# Altium schematic sheet lipo battery.SchDoc
size A; SheetNumber: 1; SheetTotal: 1
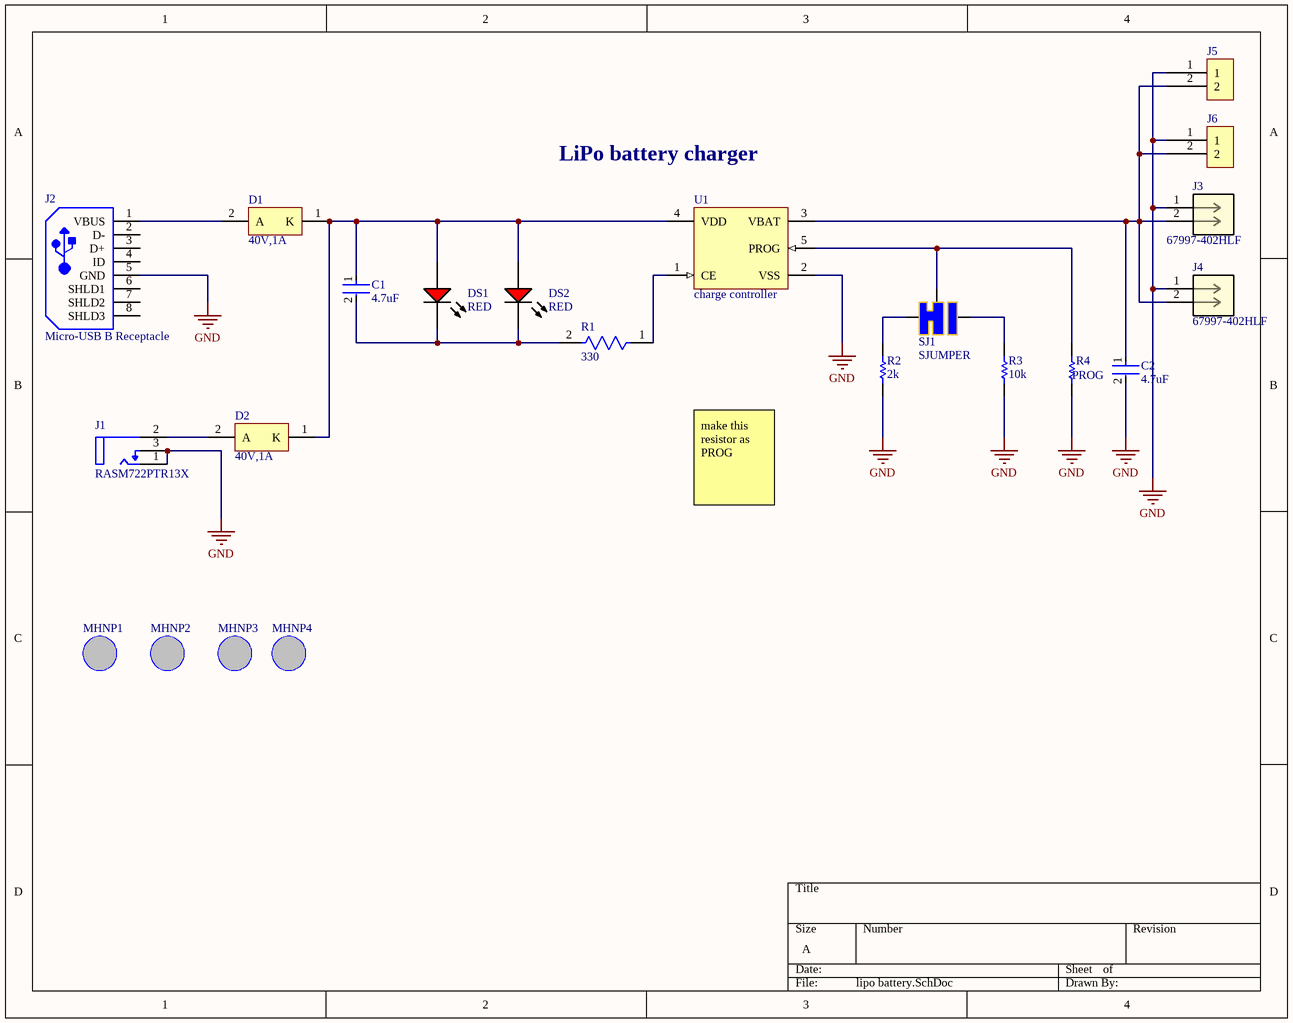
[diagram p0: lipo battery.SchDoc]

## Parts
C1  4.7uF  [FP-CC0603-DA-MFG]
C2  4.7uF  [FP-CC0603-DA-MFG]
D1  40V,1A  [ONSC-SMA-2-403D-02_V]
D2  40V,1A  [ONSC-SMA-2-403D-02_V]
DS1  RED  [VISH-TLMS1000_V]
DS2  RED  [VISH-TLMS1000_V]
J1  RASM722PTR13X  [FP-RASM722PTR13X-MFG]
J2  Micro-USB B Receptacle  [MOLX-105133-0001_V]
J3  67997-402HLF  [2Pins_AMP]
J4  67997-402HLF  [2Pins_AMP]
J5  CONN HEADER R/A 2POS 5.08MM  [1-179276-2]  (value not drawn)
J6  CONN HEADER R/A 2POS 5.08MM  [1-179276-2]  (value not drawn)
MHNP1  MOUNTING HOLE NON PLATED 3.2MM  [MPHNP3P2MM]  (value not drawn)
MHNP2  MOUNTING HOLE NON PLATED 3.2MM  [MPHNP3P2MM]  (value not drawn)
MHNP3  MOUNTING HOLE NON PLATED 3.2MM  [MPHNP3P2MM]  (value not drawn)
MHNP4  MOUNTING HOLE NON PLATED 3.2MM  [MPHNP3P2MM]  (value not drawn)
R1  330  [FP-CRCW0805-e3-MFG]
R2  2k  [RESC2013X70X40LL20T20]
R3  10k  [RESC2013X70X40ML20T20]
R4  PROG  [VISH-A1-2_V2]
SJ1  SJUMPER  [SJUMPER]
U1  charge controller  [SOT-23-OT5_M]

## Nets
GND: C2.2 J1.1(TIP_TERMINAL(CENTER_PIN)) J1.3(SHUNT_TERMINAL) J2.5(GND) J3.1 J4.1 J5.1 J6.1 R2.1 R3.1 R4.1 U1.2(VSS)
NetC1_1: C1.1 D1.1(K) D2.1(K) DS1.1(A) DS2.1(A) U1.4(VDD)
NetC1_2: C1.2 DS1.2(K) DS2.2(K) R1.2
NetC2_1: C2.1 J3.2 J4.2 J5.2 J6.2 U1.3(VBAT)
NetD1_2: D1.2(A) J2.1(VBUS)
NetD2_2: D2.2(A) J1.2(SLEEVE_TERMINAL)
NetR1_1: R1.1 U1.1(CE)
NetR2_2: R2.2 SJ1.1
NetR3_2: R3.2 SJ1.3
NetR4_2: R4.2 SJ1.2 U1.5(PROG)

Not connected (* = marked no-connect by the designer): J2 2(D-) 3(D+) 4(ID) 6(SHLD1) 7(SHLD2) 8(SHLD3)

## Notes on the sheet
- LiPo battery charger
- make this resistor as PROG

## Library data of the parts
C1 C2 = CMP-03422-000495-1: CAP CER 4.7UF 6.3V X5R 0603; Manufacturer Part Number: CC0603KRX5R5BB475; Manufacturer: YAGEO; Tolerance: 0.1; Temperature Coefficient: 15%; Material: Ceramic; Voltage Rating: 6.3 V; Height: 0.9mm; Temperature Characteristic: X5R; Value: 4.7 uF; ComponentLink2Description: Datasheet; Mouser Description: Multilayer Ceramic Capacitor, CC Series, 4.7 - F, - 10%, X5R, 6.3 V, 0603 [1608 Metric]; Voltage: 6.3 V; Device Class L3: Ceramic Capacitors; Temperature: -55°C to +125°C; Octopart: https://octopart.com/cc0603krx5r5bb475-yageo-42244632; Digikey Description: CAP CER 4.7UF 6.3V X5R 0603; Package: CC0603-DA; Device Class L2: Capacitors; Category: Cap; Footprint Url: http://www.yageo.com/exep/pages/download/literatures/UPY-C_GEN_24.pdf; ComponentLink2URL: http://www.yageo.com/documents/recent/UPY-GPHC_X7R_6.3V-to-50V_18.pdf; Temperature Range High: +125°C; Automotive: No; Temperature Range Low: -55°C; Lead Free: Yes; Capacitance: 4.7 uF; Device Class L1: Passive Components; RoHS: TRUE
D1 D2 = CMP-1055-00320-1: Schottky Power Rectifier, 2-Pin SMA, Pb-Free, Tape and Reel; PartNumber: MBRA140T3G; Manufacturer: On Semiconductor; Configuration: Single; IFSM Max (A): 30; PackageReference: SMA-2-403D-02; PackageDescription: 2-Pin Small Molded Package, J-Bend Lead, Body 2.605 x 4.315 mm; RoHS: TRUE; ComponentLink1Description: Manufacturer URL; Packing: Tape and Reel; ComponentLink3URL: http://www.onsemi.com/pub_link/Collateral/403D-02.PDF; ComponentLink2Description: Datasheet; ComponentLink2URL: http://www.onsemi.cn/pub_link/Collateral/MBRA140T3-D.PDF; DatasheetVersion: Rev. 10; ComponentLink1URL: http://www.onsemi.com/; ComponentLink3Description: Package Specification; Mounting Technology: Surface Mount; PackageVersion: Rev. G, 07/2012
DS1 DS2 = CMP-2000-07254-1: Low Current LED, 40 mW, 1.8 V, -40 to 100 degC, 2-Pin SMD (0603), RoHS, Tape and Reel; Manufacturer: Vishay; Lens Shape: Rectangular; Automotive Qualification Standard: AEC-Q100; Wavelength Typ: 636nm; SVHC: ToBeAdvised; Bulb Size: 1.6mmx0.8mm; Forward Voltage: 1.8V; Luminous Intensity: 4mcd; Forward Current If: 2mA; Viewing Angle: 80°; Datasheet Version: Rev. 1.7, 02/2011; Datasheet URL: https://datasheet.ciiva.com/5798/1698881-5798337.pdf; LED Mounting: SMD; Packaging: CutTape; Package Reference: TLMS1000; Manufacturer URL: http://www.vishay.com/; Mounting Technology: SurfaceMount; Product Range: -; LED Colour: Red; Package Description: 2-Pin Surface Mount Device, Body 1.6 x 0.8 mm; MSL: MSL2-1year
J1 = CMP-47995-000002-1: CONN PWR JACK 2.1X5.5MM SOLDER; Shielding: Unshielded; Gender: Male; Current Rating: 5A; Termination: Solder; Contact Material: Copper Alloy; Package Quantity: 120; Case/Package: SMD/SMT; Contact Plating: Tin; Connector Type: Jack; Housing Material: Thermoplastic; Mount: Surface Mount; Housing Color: Black; Color: Black
J2 = CMP-2000-05829-1: Micro-USB B Receptacle, Vertical, -30 to 85 degC, 5-Pin SMD, RoHS, Tape and Reel; Manufacturer: Molex; PartNumber: 105133-0001; Package Version: Rev. C, 11/2015; Voltage Rating: 30VAC; Connector Type: MicroUSBTypeBReceptacle; Current Rating: 1.8A; Number of Ports: 1; Voltage - Max: 30V; Mounting Style: SMD/SMT; Packaging: Reel; Product: MicroUSBTypeBConnectors; Contact Plating: Gold; Flammability Rating: UL94V-0; Package Description: 5-Pin Surface Mount Device, Pitch 0.65 mm; Package Reference: 105133-0001; Contact Material: CopperAlloy; Mounting Angle: Vertical; RoHS: Details; Manufacturer URL: http://www.molex.com/; Factory Pack Quantity: 6000; Standard: USB; Brand: Molex; Series: 105133; Product Category: USBConnectors; Termination Style: SolderTail; Gender: Receptacle; Package URL: http://www.molex.com/pdm_docs/sd/1051330001_sd.pdf; Datasheet Version: 03/2016; Color: Black; Datasheet URL: http://www.molex.com/webdocs/datasheets/pdf/en-us/1051330001_IO_CONNECTORS.pdf; Mounting Technology: SurfaceMount
J3 J4 = 67997-402HLF: No Description Available; Mfr_Name: Amphenol ICC; RefDes: RefDes; Type: Type
J5 J6 = 1-179276-2: manufacturer: TE Connectivity AMP Connectors; Supplier 1: Rs; manufacturer part number: 1-179276-2; ComponentLink1Description: product url; ComponentLink1URL: https://www.digikey.com/en/products/detail/te-connectivity-amp-connectors/1-179276-2/664296; Supplier Part Number 1: 7189696P
MHNP1-MHNP4 = MTH3P2MM: MOUNTING HOLE NON PLATED 3.2MM DRILL HOLE
R1 = CMP-2001-03823-2: RES Thick Film, 330Ω, 1%, 0.125W, 100ppm/°C, 0805; Voltage Rating (DC): 150V; Resistance: 330R; Max Power Dissipation: 125mW; Mount: Surface Mount; Packaging: Tape and Reel; Min Operating Temperature: -55°C; Military Standard: Not; Case Code (Metric): 2012; Height: 0.02inch; Voltage Rating: 150V; Case/Package: 0805; Max Operating Temperature: 155°C; Width: 0.049inch; Case Code (Imperial): 0805; Termination: SMD/SMT; Lead Free: Lead Free; Contact Plating: Tin; Package Quantity: 10; Composition: Thick Film; Length: 2mm; Features: Automotive AEC-Q200; Depth: 1.25mm; Weight: 0.000194oz; Tolerance: 1%; Power Rating: 125mW; Number of Terminations: 2; Temperature Coefficient: 100ppm/°C
R2 = CMP-2001-00370-1: Part Number: ERJ-6GEYJ202V; Manufacturer: Panasonic
R3 = CMP-2001-04376-1: Manufacturer: Panasonic; Part Number: ERJ-6ENF1002V
R4 = CMP-1240-00001-1: Power Metal Film Leaded Resistor, 62 KOhm +/-5%, 2 W, 2-Pin THD, RoHS, Ammo Pack; PartNumber: PR02000206202JA100; Manufacturer: Vishay Semiconductor; Resistance: 62 KOhm; Temperature Coefficient: +/-250 ppm/degC; Power: 2 W; ComponentLink2URL: http://www.vishay.com/docs/28729/28729.pdf; Mounting Technology: Through Hole; Tolerance: +/-5%; ComponentLink3Description: Package Specification; ComponentLink3URL: http://www.vishay.com/docs/28729/28729.pdf; ComponentLink1Description: Manufacturer URL; ComponentLink2Description: Datasheet; DatasheetVersion: Jun-13; PackageDescription: 2-Pin Axial Lead, Body 10 x 3.9 mm; ComponentLink1URL: http://www.vishay.com/; Packing: Ammo Pack; RoHS: TRUE
SJ1 = SJUMPER: solder jumper 3 pads and pins
U1 = CMP-0133-00139-1: Simple, Miniature Single-Cell, Fully Integrated Li-Ion/Li-Polymer Charge Management Controller, 4.2V, 5-Pin SOT-23, Industrial Temperature, Tape and Reel; Code_IPC: SOT23-5; PackageDescription: 5-Lead Plastic Small Outline Transistor (OT) [SOT-23]; PackageVersion: revBB, Aug-2009; DatasheetVersion: revB, Sep-2007; PackageReference: SOT-23-OT5